# Altium schematic sheet Sheet1.SchDoc
size A; SheetNumber: 1; SheetTotal: 1
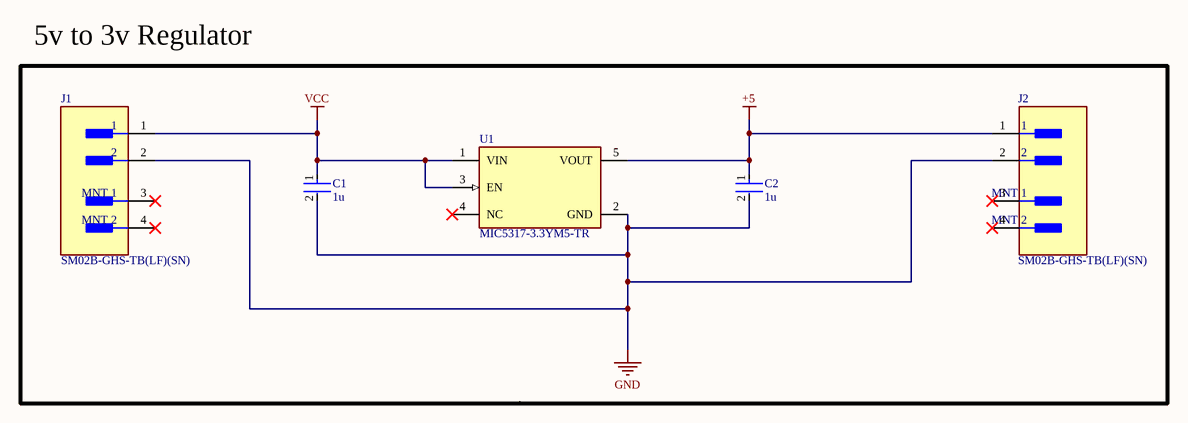
[diagram p0: Sheet1.SchDoc]

## Parts
C1  1u  [FP-CC0805-0_2-1_45-IPC_A]
C2  1u  [FP-CC0805-0_2-1_45-IPC_A]
J1  SM02B-GHS-TB(LF)(SN)  [FP-SM02B-GHS-TB_LF_SN-MFG]
J2  SM02B-GHS-TB(LF)(SN)  [FP-SM02B-GHS-TB_LF_SN-MFG]
U1  MIC5317-3.3YM5-TR  [FP-SOT23-5LD-PL-1-MFG]

## Blocks framed on the sheet
5v to 3v Regulator: C1 C2 J1 J2 U1

## Nets
+5: C2.1 J2.1 U1.5(VOUT)
GND: C1.2 C2.2 J1.2 J2.2 U1.2(GND)
VCC: C1.1 J1.1 U1.1(VIN) U1.3(EN)

Not connected (* = marked no-connect by the designer): J1 3(MNT_1)* 4(MNT_2)*; J2 3(MNT_1)* 4(MNT_2)*; U1 4(NC)*

## Library data of the parts
C1 C2 = CMP-1036-04922-3: CAP CER 10UF 10V X5R 0805; Tolerance: 10%; Dissipation Factor: 15%; Voltage Rating: 10V; Case/Package: 0805; Series: CC; Package Quantity: 1; Max Operating Temperature: 85°C; Min Operating Temperature: -55°C; Radiation Hardening: No; Termination: SMD/SMT; Voltage Rating (DC): 10V; Width: 0.049inch; Height: 0.85mm; Packaging: Tape and Reel; Voltage: 10V; Halogen Free: Halogen Free; Lead Free: Lead Free; Case Code (Imperial): 0805; Resistor Type: Ceramic; Length: 2mm; Construction: Flat; Mount: Surface Mount; Capacitance: 10uF; Depth: 1.25mm; Number of Pins: 2; Dielectric: X5R; RoHS Compliant: Yes; Case Code (Metric): 2012
J1 J2 = CMP-2000-07076-2: CONN HEADER SMD R/A 2POS 1.25MM; Voltage Rating: 50V; Number of Positions: 2; Pitch: 0.049inch; Current Rating: 1A; Connector Type: Outer Shroud Contact; Number of Rows: 1; Contact Material: Bronze; Termination: Solder; Color: Natural; Package Quantity: 2500; Mount: Surface Mount; Housing Color: Natural; Number of Contacts: 2; Packaging: Tape and Reel; Lead Free: Lead Free; Housing Material: Nylon; Orientation: Right Angle; Contact Type: Male Pin; Contact Plating: Tin; Series: GH; Fastening Type: Latch
U1 = CMP-06324-000116-1: IC REG LINEAR 3.3V 150MA SOT23-5; Max Input Voltage: 6V; Number of Regulators: 1; Min Current Limit: 200mA; Dropout Voltage: 155mV; Min Input Voltage: 2.5V; Power Supply Rejection Ratio (PSRR): 70dB; Case/Package: SOT-23-5; Output Voltage: 3.3V; Series: -; Max Operating Temperature: 125°C; Package Quantity: 3000; Mount: Surface Mount; Packaging: Tape and Reel; RoHS Compliant: No; Output Current: 150mA; Min Operating Temperature: -40°C; Number of Outputs: 1